# Altium schematic sheet [17]-ETH_CONNECTOR.SchDoc
size A4
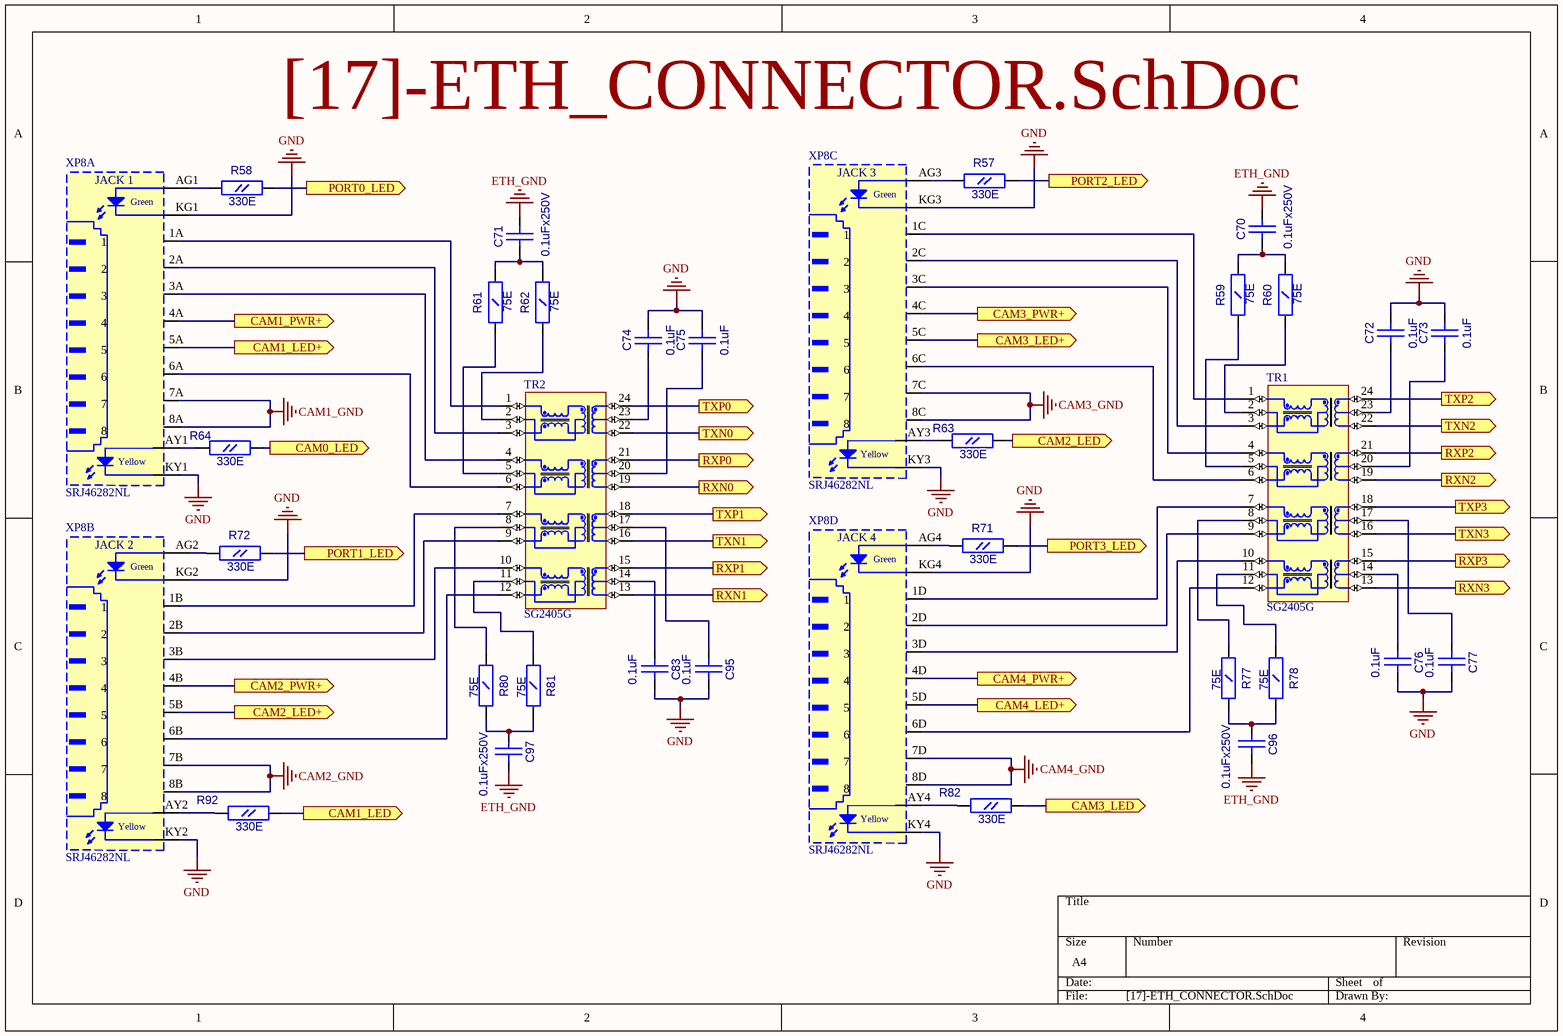
[diagram p0: [17]-ETH_CONNECTOR.SchDoc]

## Parts
C70  0.1uFx250V  [CC1206]
C71  0.1uFx250V  [CC1206]
C72  0.1uF  [CC0603]
C73  0.1uF  [CC0603]
C74  0.1uF  [CC0603]
C75  0.1uF  [CC0603]
C76  0.1uF  [CC0603]
C77  0.1uF  [CC0603]
C83  0.1uF  [CC0603]
C95  0.1uF  [CC0603]
C96  0.1uFx250V  [CC1206]
C97  0.1uFx250V  [CC1206]
R57  330E  [RC0603]
R58  330E  [RC0603]
R59  75E  [RC1206]
R60  75E  [RC1206]
R61  75E  [RC1206]
R62  75E  [RC1206]
R63  330E  [RC0603]
R64  330E  [RC0603]
R71  330E  [RC0603]
R72  330E  [RC0603]
R77  75E  [RC1206]
R78  75E  [RC1206]
R80  75E  [RC1206]
R81  75E  [RC1206]
R82  330E  [RC0603]
R92  330E  [RC0603]
TR1  SG2405G  [SG2405G]
TR2  SG2405G  [SG2405G]
XP8  SRJ46282NL  [SRJ46282NL]  (parts A,B,C,D of 4)

## Ports
CAM0_LED (out), CAM1_LED (out), CAM1_LED+ (out), CAM1_PWR+ (out), CAM2_LED (out), CAM2_LED+ (out), CAM2_PWR+ (out), CAM3_LED (out), CAM3_LED+ (out), CAM3_PWR+ (out), CAM4_LED+ (out), CAM4_PWR+ (out), PORT0_LED (out), PORT1_LED (out), PORT2_LED (out), PORT3_LED (out), RXN0 (out), RXN1 (out), RXN2 (out), RXN3 (out), RXP0 (out), RXP1 (out), RXP2 (out), RXP3 (out), TXN0 (out), TXN1 (out), TXN2 (out), TXN3 (out), TXP0 (out), TXP1 (out), TXP2 (out), TXP3 (out)

## Nets
CAM1_GND: XP8.7A XP8.8A
CAM2_GND: XP8.7B XP8.8B
CAM3_GND: XP8.7C XP8.8C
CAM4_GND: XP8.7D XP8.8D
ETH_GND: C70.2(B) C71.2(B) C96.2(B) C97.2(B)
GND: C72.2(B) C73.2(B) C74.2(B) C75.2(B) C76.2(B) C77.2(B) C83.2(B) C95.2(B) XP8.KG1(D2) XP8.KG2(D2) XP8.KG3(D2) XP8.KG4(D2) XP8.KY1(D4) XP8.KY2(D4) XP8.KY3(D4) XP8.KY4(D4)
CAM0_LED: R64.2(B) ; port CAM0_LED
CAM1_LED: R92.2(B) ; port CAM1_LED
CAM1_LED+: XP8.5A ; port CAM1_LED+
CAM1_PWR+: XP8.4A ; port CAM1_PWR+
CAM2_LED: R63.2(B) ; port CAM2_LED
CAM2_LED+: XP8.5B ; port CAM2_LED+
CAM2_PWR+: XP8.4B ; port CAM2_PWR+
CAM3_LED: R82.2(B) ; port CAM3_LED
CAM3_LED+: XP8.5C ; port CAM3_LED+
CAM3_PWR+: XP8.4C ; port CAM3_PWR+
CAM4_LED+: XP8.5D ; port CAM4_LED+
CAM4_PWR+: XP8.4D ; port CAM4_PWR+
PORT0_LED: R58.2(B) ; port PORT0_LED
PORT1_LED: R72.2(B) ; port PORT1_LED
PORT2_LED: R57.2(B) ; port PORT2_LED
PORT3_LED: R71.2(B) ; port PORT3_LED
RXN0: TR2.19(TX1-) ; port RXN0
RXN1: TR2.13(RX2-) ; port RXN1
RXN2: TR1.19(TX1-) ; port RXN2
RXN3: TR1.13(RX2-) ; port RXN3
RXP0: TR2.21(TX1+) ; port RXP0
RXP1: TR2.15(RX2+) ; port RXP1
RXP2: TR1.21(TX1+) ; port RXP2
RXP3: TR1.15(RX2+) ; port RXP3
TXN0: TR2.22(RX1-) ; port TXN0
TXN1: TR2.16(TX2-) ; port TXN1
TXN2: TR1.22(RX1-) ; port TXN2
TXN3: TR1.16(TX2-) ; port TXN3
TXP0: TR2.24(RX1+) ; port TXP0
TXP1: TR2.18(TX2+) ; port TXP1
TXP2: TR1.24(RX1+) ; port TXP2
TXP3: TR1.18(TX2+) ; port TXP3
NetC70_1: C70.1(A) R59.2(B) R60.2(B)
NetC71_1: C71.1(A) R61.2(B) R62.2(B)
NetC72_1: C72.1(A) TR1.23(RXCT1)
NetC73_1: C73.1(A) TR1.20(TXCT1)
NetC74_1: C74.1(A) TR2.23(RXCT1)
NetC75_1: C75.1(A) TR2.20(TXCT1)
NetC76_1: C76.1(A) TR1.14(RXCT2)
NetC77_1: C77.1(A) TR1.17(TXCT2)
NetC83_1: C83.1(A) TR2.14(RXCT2)
NetC95_1: C95.1(A) TR2.17(TXCT2)
NetC96_1: C96.1(A) R77.2(B) R78.2(B)
NetC97_1: C97.1(A) R80.2(B) R81.2(B)
NetR57_1: R57.1(A) XP8.AG3(D1)
NetR58_1: R58.1(A) XP8.AG1(D1)
NetR59_1: R59.1(A) TR1.5(TCT1)
NetR60_1: R60.1(A) TR1.2(RCT1)
NetR61_1: R61.1(A) TR2.5(TCT1)
NetR62_1: R62.1(A) TR2.2(RCT1)
NetR63_1: R63.1(A) XP8.AY3(D3)
NetR64_1: R64.1(A) XP8.AY1(D3)
NetR71_1: R71.1(A) XP8.AG4(D1)
NetR72_1: R72.1(A) XP8.AG2(D1)
NetR77_1: R77.1(A) TR1.8(TCT2)
NetR78_1: R78.1(A) TR1.11(RCT2)
NetR80_1: R80.1(A) TR2.8(TCT2)
NetR81_1: R81.1(A) TR2.11(RCT2)
NetR82_1: R82.1(A) XP8.AY4(D3)
NetR92_1: R92.1(A) XP8.AY2(D3)
NetTR1_1: TR1.1(RD1+) XP8.1C
NetTR1_3: TR1.3(RD1-) XP8.2C
NetTR1_4: TR1.4(TD1+) XP8.3C
NetTR1_6: TR1.6(TD1-) XP8.6C
NetTR1_7: TR1.7(TD2+) XP8.1D
NetTR1_9: TR1.9(TD2-) XP8.2D
NetTR1_10: TR1.10(RD2+) XP8.3D
NetTR1_12: TR1.12(RD2-) XP8.6D
NetTR2_1: TR2.1(RD1+) XP8.1A
NetTR2_3: TR2.3(RD1-) XP8.2A
NetTR2_4: TR2.4(TD1+) XP8.3A
NetTR2_6: TR2.6(TD1-) XP8.6A
NetTR2_7: TR2.7(TD2+) XP8.1B
NetTR2_9: TR2.9(TD2-) XP8.2B
NetTR2_10: TR2.10(RD2+) XP8.3B
NetTR2_12: TR2.12(RD2-) XP8.6B

## Notes on the sheet
- (in symbol SRJ46282NL, part A) JACK 1; Green; 2; 3; 4; 5; 6; 7; 8; Yellow
- (in symbol SRJ46282NL, part B) JACK 2; Green; 2; 3; 4; 5; 6; 7; 8; Yellow
- (in symbol SRJ46282NL, part C) JACK 3; Green; 2; 3; 4; 5; 6; 7; 8; Yellow
- (in symbol SRJ46282NL, part D) JACK 4; Green; 2; 3; 4; 5; 6; 7; 8; Yellow

## Library data of the parts
C70 C71 C96 C97 = CC1206: Value: 0.1uFx250V
C72-C77 C83 C95 = CC0603: Value: 0.1uF
R57 R58 R63 R64 R71 R72 R82 R92 = RC0603: Value: 330E
R59-R62 R77 R78 R80 R81 = RC1206: Value: 75E
TR1 TR2 = SG2405G: Ehternet transformer Gigabit or 2 LAN10/100; Value: SG2405G
XP8 = SRJ46282NL: Value: SRJ46282NL